# EAGLE design PCB_Tester2_V1.0 (EAGLE 8.6.3)
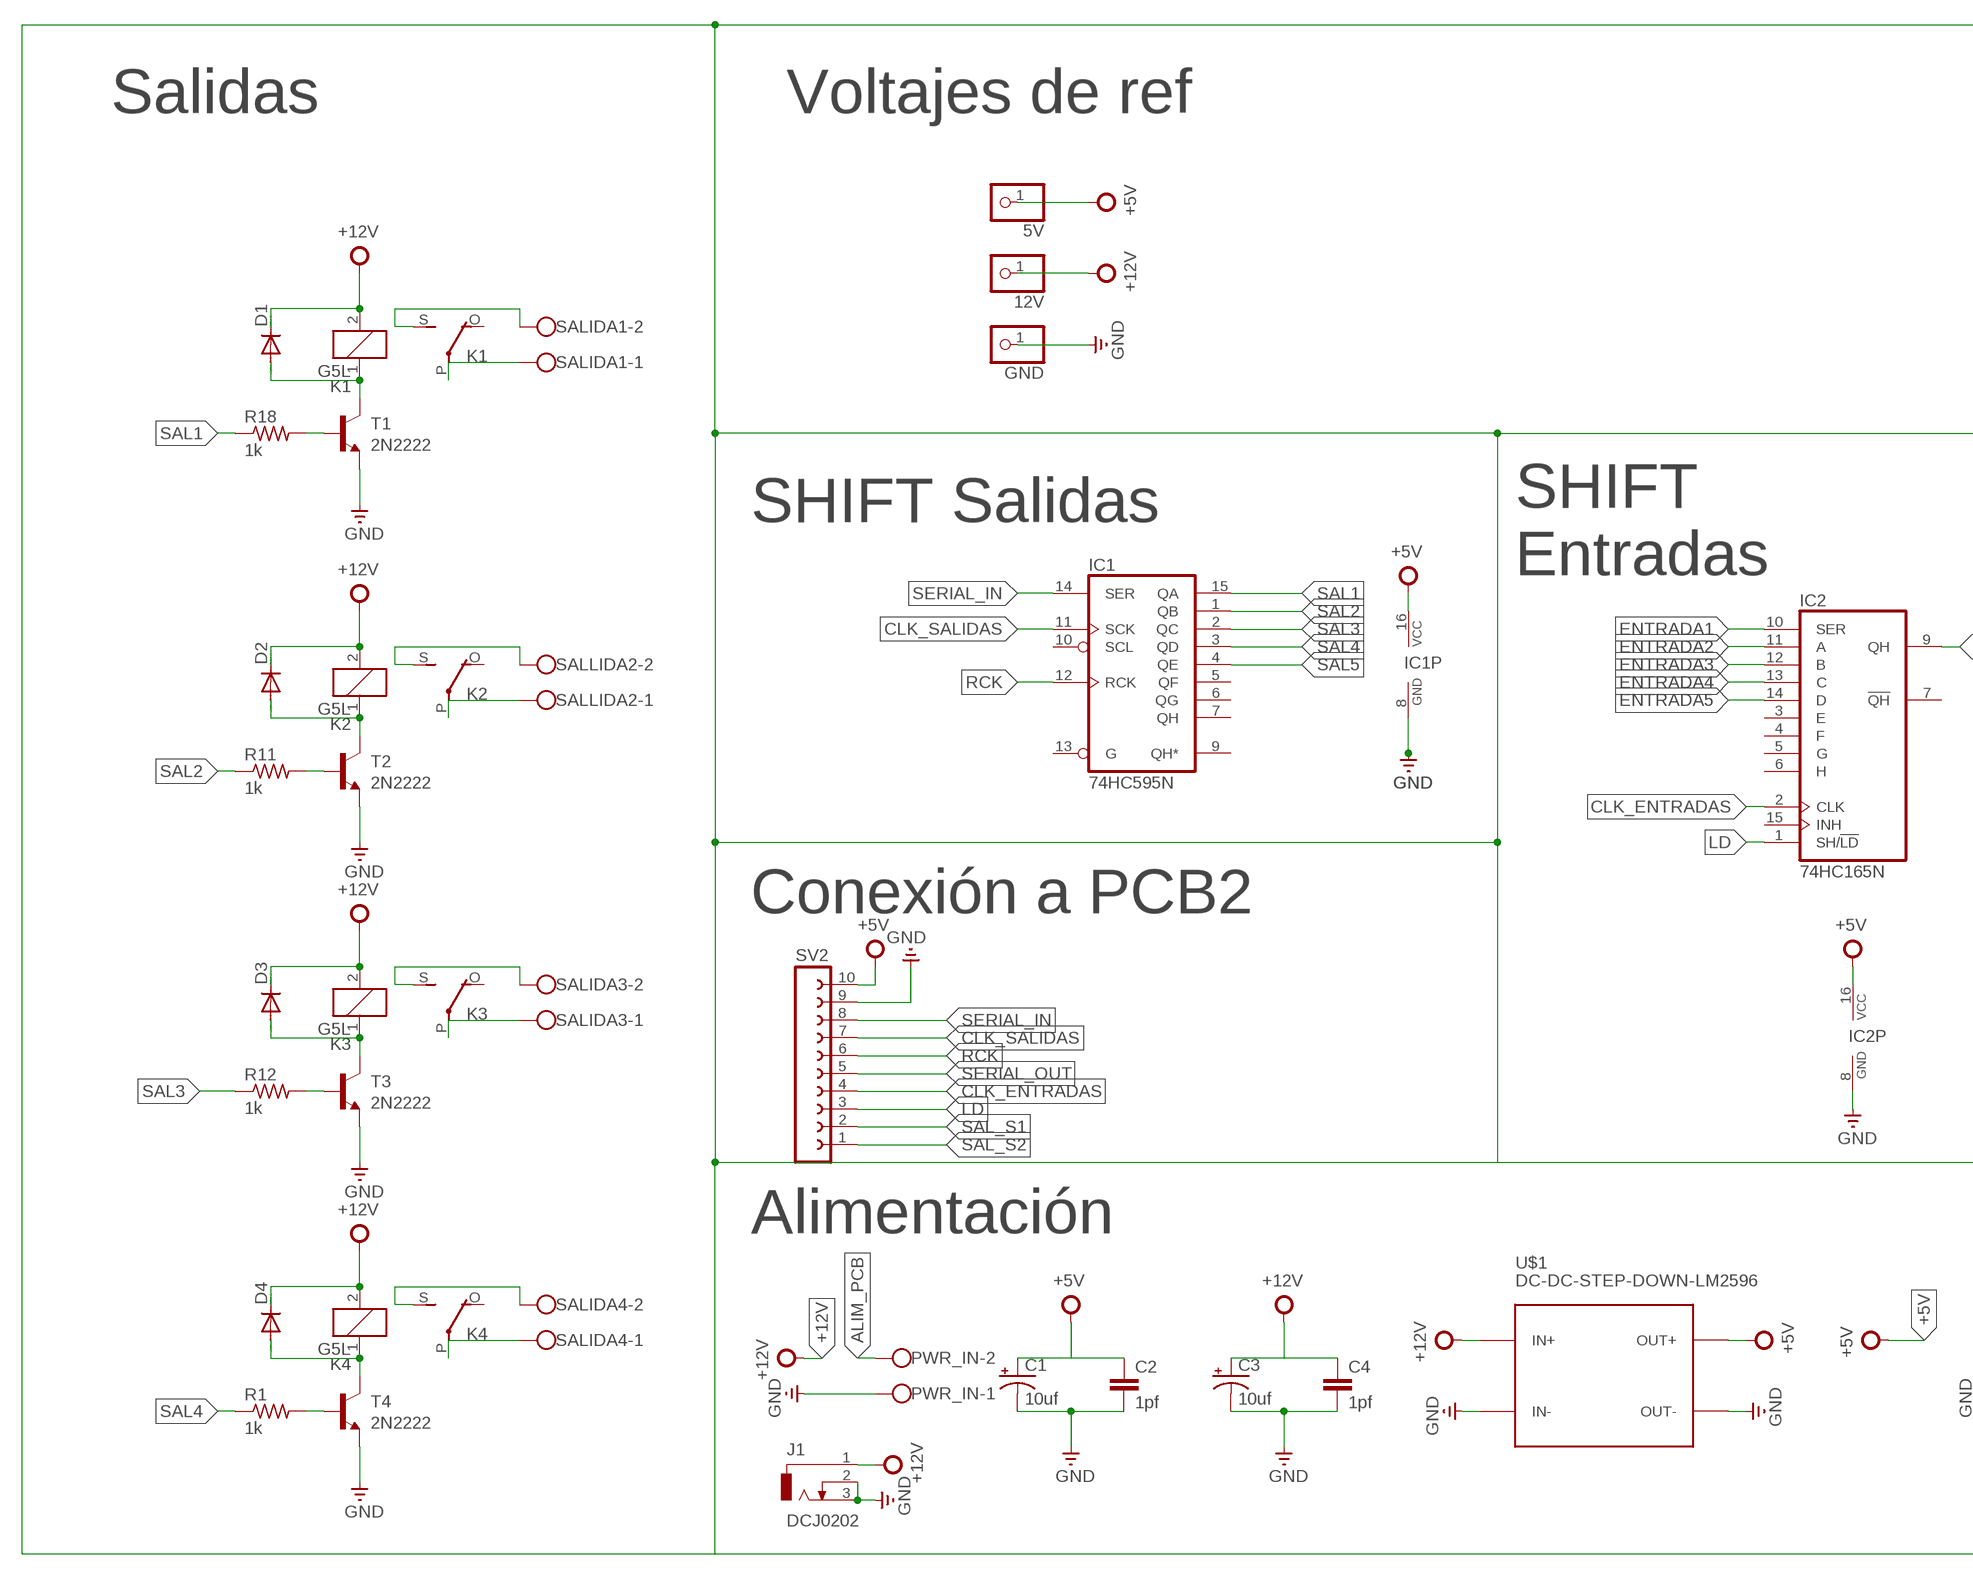
[diagram p0: schematic, sheet 1, part 1 of 2]
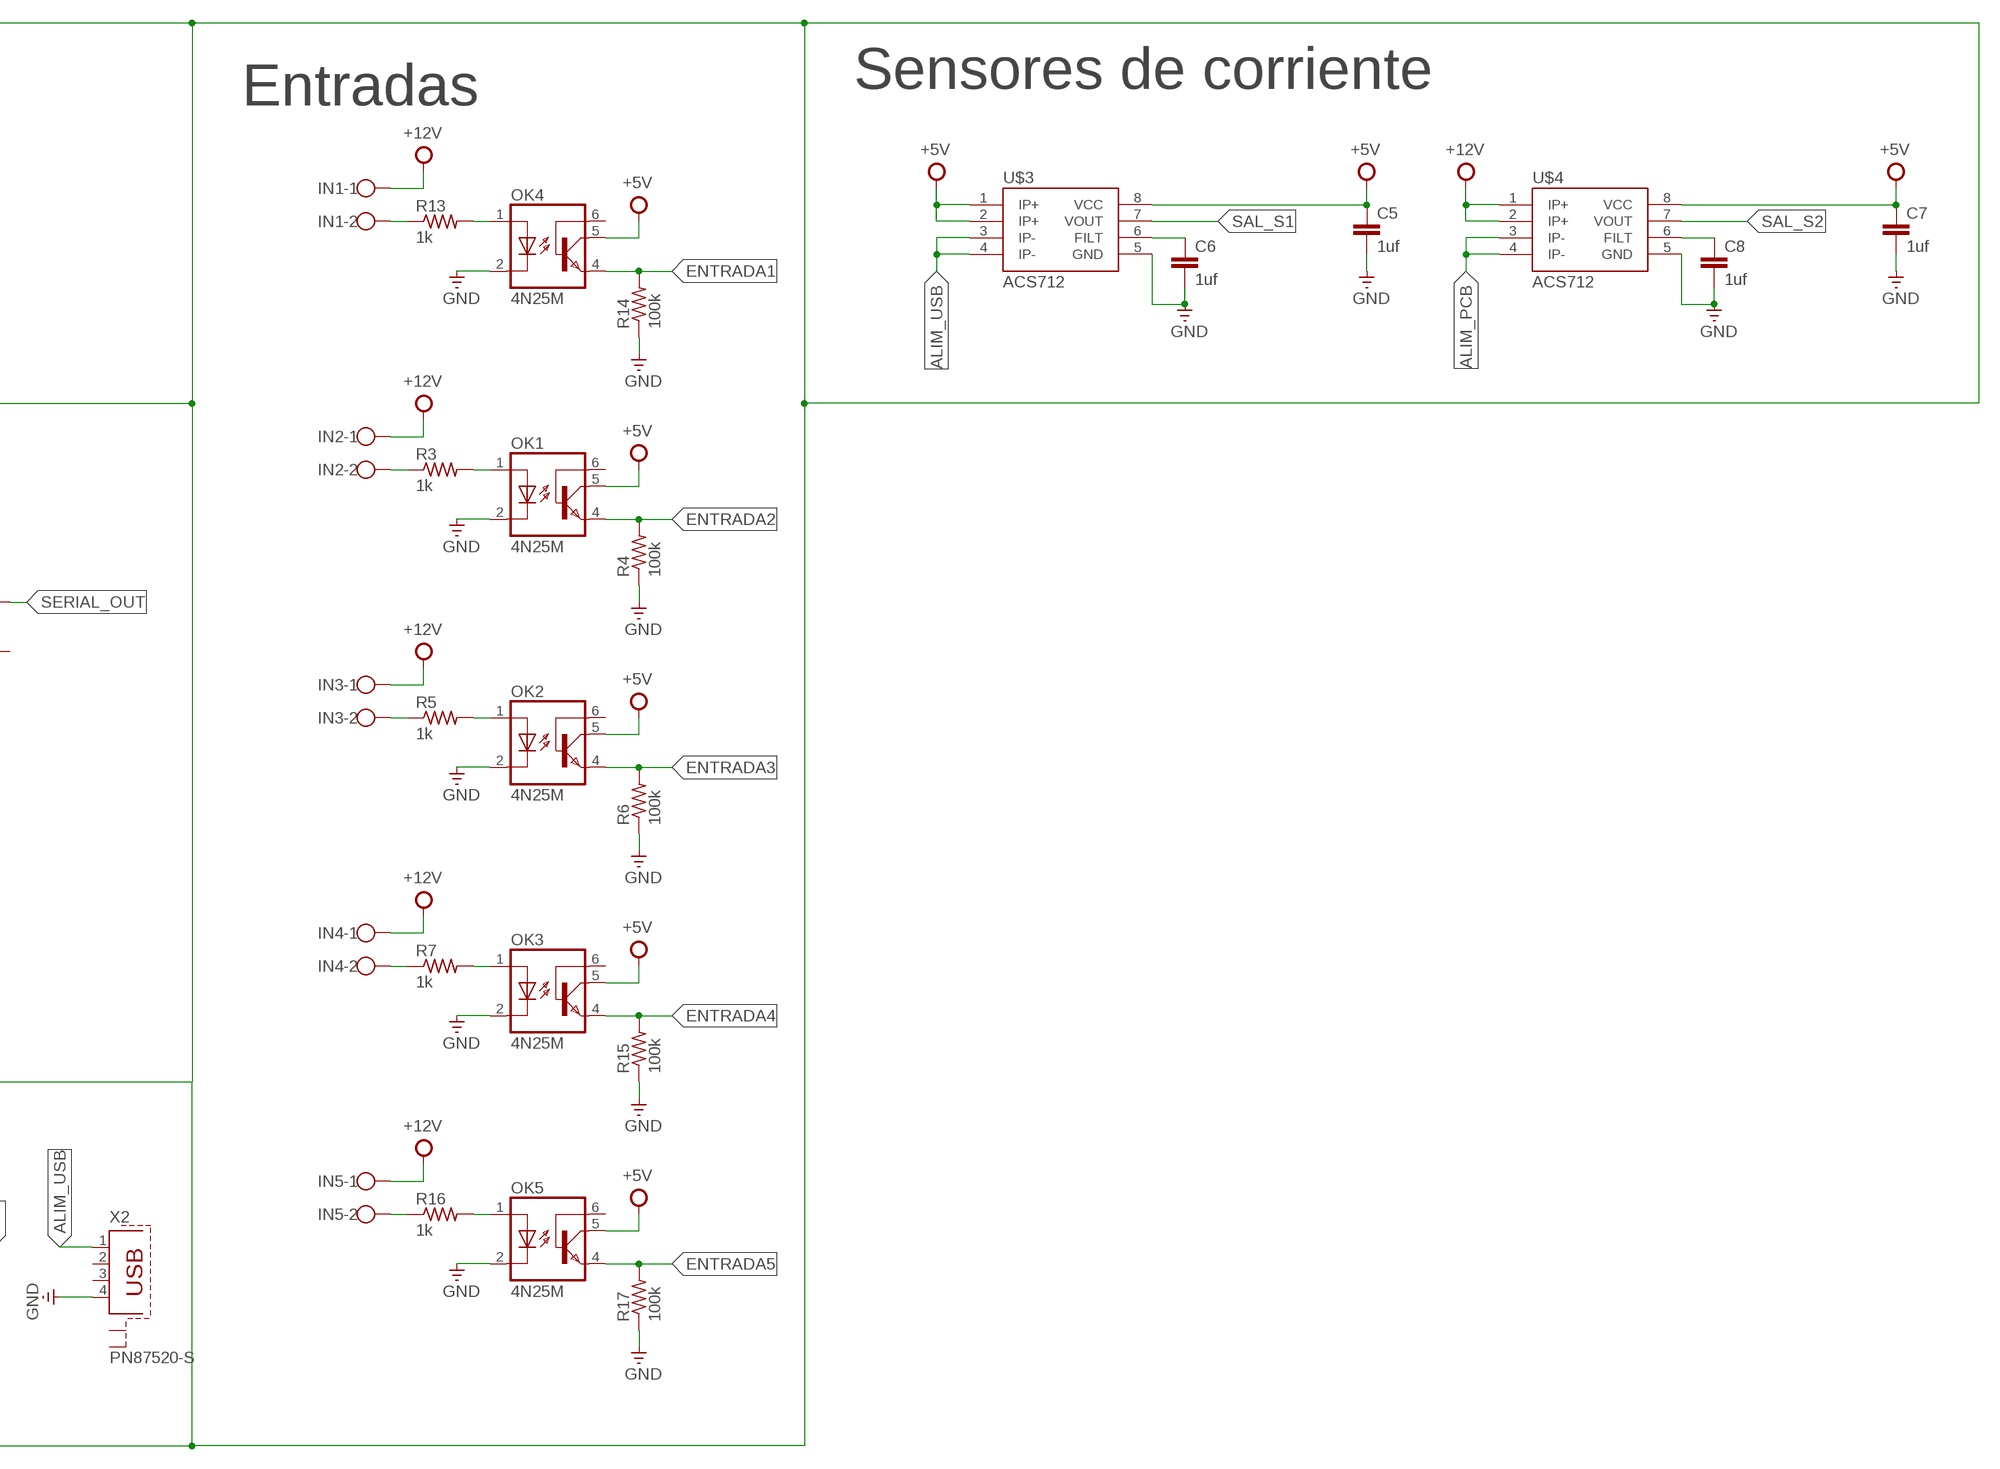
[diagram p1: schematic, sheet 1, part 2 of 2]

## Parts
5V  PINHD-1X1  [1X01]
12V  PINHD-1X1  [1X01]
C1  10uf  CPOL-USE2.5-6  [E2,5-6]
C2  1pf  C2,5-3  [C2.5-3]
C3  10uf  CPOL-USE2.5-6  [E2,5-6]
C4  1pf  C2,5-3  [C2.5-3]
C5  1uf  C2,5-3  [C2.5-3]
C6  1uf  C2,5-3  [C2.5-3]
C7  1uf  C2,5-3  [C2.5-3]
C8  1uf  C2,5-3  [C2.5-3]
D1  1N4148DO35-7  [DO35-7]
D2  1N4148DO35-7  [DO35-7]
D3  1N4148DO35-7  [DO35-7]
D4  1N4148DO35-7  [DO35-7]
GND  PINHD-1X1  [1X01]
IC1  74HC595N  [DIL16]
IC2  74HC165N  [DIL16]
IN1  W237-102  [W237-102]
IN2  W237-102  [W237-102]
IN3  W237-102  [W237-102]
IN4  W237-102  [W237-102]
IN5  W237-102  [W237-102]
J1  DCJ0202  [DCJ0202]
K1  G5L  [G5LE]
K2  G5L  [G5LE]
K3  G5L  [G5LE]
K4  G5L  [G5LE]
OK1  4N25M  [DIL06]
OK2  4N25M  [DIL06]
OK3  4N25M  [DIL06]
OK4  4N25M  [DIL06]
OK5  4N25M  [DIL06]
PWR_IN  W237-102  [W237-102]
R1  1k  R-US_0207/7  [0207/7]
R3  1k  R-US_0207/7  [0207/7]
R4  100k  R-US_0207/7  [0207/7]
R5  1k  R-US_0207/7  [0207/7]
R6  100k  R-US_0207/7  [0207/7]
R7  1k  R-US_0207/7  [0207/7]
R11  1k  R-US_0207/7  [0207/7]
R12  1k  R-US_0207/7  [0207/7]
R13  1k  R-US_0207/7  [0207/7]
R14  100k  R-US_0207/7  [0207/7]
R15  100k  R-US_0207/7  [0207/7]
R16  1k  R-US_0207/7  [0207/7]
R17  100k  R-US_0207/7  [0207/7]
R18  1k  R-US_0207/7  [0207/7]
SALIDA1  W237-102  [W237-102]
SALIDA3  W237-102  [W237-102]
SALIDA4  W237-102  [W237-102]
SALLIDA2  W237-102  [W237-102]
SV2  FE10-1  [FE10]
T1  2N2222  [TO18]
T2  2N2222  [TO18]
T3  2N2222  [TO18]
T4  2N2222  [TO18]
U$1  DC-DC-STEP-DOWN-LM2596  [DC-DC-STEP-DOWN-LM2596]
U$3  ACS712  [SO08]
U$4  ACS712  [SO08]
X2  PN87520-S  [PN87520-S]

## Nets
+5V: 5V.1 C1.+ C2.1 C5.1 C7.1 IC1.16(VCC) IC2.16(VCC) OK1.5(COL) OK2.5(COL) OK3.5(COL) OK4.5(COL) OK5.5(COL) SV2.10 U$1.OUT+ U$3.1(IP+) U$3.2(IP+) U$3.8(VCC) U$4.8(VCC)
+12V: 12V.1 C3.+ C4.1 D1.C D2.C D3.C D4.C IN1.1 IN2.1 IN3.1 IN4.1 IN5.1 J1.1 K1.2 K2.2 K3.2 K4.2 U$1.IN+ U$4.1(IP+) U$4.2(IP+)
ALIM_PCB: PWR_IN.2 U$4.3(IP-) U$4.4(IP-)
ALIM_USB: U$3.3(IP-) U$3.4(IP-) X2.1
CLK_ENTRADAS: IC2.2(CLK) SV2.4
CLK_SALIDAS: IC1.11(SCK) SV2.7
ENTRADA1: IC2.10(SER) OK4.4(EMI) R14.2
ENTRADA2: IC2.11(A) OK1.4(EMI) R4.2
ENTRADA3: IC2.12(B) OK2.4(EMI) R6.2
ENTRADA4: IC2.13(C) OK3.4(EMI) R15.2
ENTRADA5: IC2.14(D) OK5.4(EMI) R17.2
GND: C1.- C2.2 C3.- C4.2 C5.2 C6.2 C7.2 C8.2 GND.1 IC1.8(GND) IC2.8(GND) J1.2 J1.3 OK1.2(C) OK2.2(C) OK3.2(C) OK4.2(C) OK5.2(C) PWR_IN.1 R4.1 R6.1 R14.1 R15.1 R17.1 SV2.9 T1.1(E) T2.1(E) T3.1(E) T4.1(E) U$1.IN- U$1.OUT- U$3.5(GND) U$4.5(GND) X2.4
LD: IC2.1(SH/!LD) SV2.3
N$1: D4.A K4.1 T4.3(C)
N$2: R1.2 T4.2(B)
N$3: K4.S(2:S) SALIDA4.2
N$4: K4.P(2:P) SALIDA4.1
N$5: IN2.2 R3.1
N$8: OK1.1(A) R3.2
N$10: IN3.2 R5.1
N$12: OK2.1(A) R5.2
N$17: D2.A K2.1 T2.3(C)
N$18: R11.2 T2.2(B)
N$19: K2.S(2:S) SALLIDA2.2
N$20: K2.P(2:P) SALLIDA2.1
N$21: D3.A K3.1 T3.3(C)
N$22: R12.2 T3.2(B)
N$23: K3.S(2:S) SALIDA3.2
N$24: K3.P(2:P) SALIDA3.1
N$25: IN1.2 R13.1
N$26: OK4.1(A) R13.2
N$27: IN4.2 R7.1
N$28: OK3.1(A) R7.2
N$29: IN5.2 R16.1
N$30: OK5.1(A) R16.2
N$31: D1.A K1.1 T1.3(C)
N$32: R18.2 T1.2(B)
N$33: K1.S(2:S) SALIDA1.2
N$34: K1.P(2:P) SALIDA1.1
N$35: C6.1 U$3.6(FILT)
N$36: C8.1 U$4.6(FILT)
RCK: IC1.12(RCK) SV2.6
SAL1: IC1.15(QA) R18.1
SAL2: IC1.1(QB) R11.1
SAL3: IC1.2(QC) R12.1
SAL4: IC1.3(QD) R1.1
SAL5: IC1.4(QE)
SAL_S1: SV2.2 U$3.7(VOUT)
SAL_S2: SV2.1 U$4.7(VOUT)
SERIAL_IN: IC1.14(SER) SV2.8
SERIAL_OUT: IC2.9(QH) SV2.5
Unconnected: IC1.5(QF) IC1.6(QG) IC1.7(QH) IC1.9(QH*) IC1.10(SCL) IC1.13(G) IC2.3(E) IC2.4(F) IC2.5(G) IC2.6(H) IC2.7(!QH) IC2.15(INH) K1.O(2:O) K2.O(2:O) K3.O(2:O) K4.O(2:O) OK1.6(BAS) OK2.6(BAS) OK3.6(BAS) OK4.6(BAS) OK5.6(BAS) X2.2 X2.3 X2.S1 X2.S2

## Notes on the sheet
- Salidas | Voltajes de ref | Entradas | Sensores de corriente
- SHIFT Salidas
- SHIFT
  Entradas
- Conexión a PCB2
- Alimentación

## Library data of the parts
5V 12V GND = adafruit:PINHD-1X1: Pin header 1x1 for 0.1" spacing With round pins
C1 C3 = adafruit:CPOL-US: POLARIZED CAPACITOR, American symbol
C2 C4-C8 = capacitor-wima:C: CAPACITOR naming: grid - package width
D1-D4 = diode:1N4148: DIODE high speed (Philips)
IC1 = 74xx-eu:74*595: 8-bit SHIFT REGISTER, output latch
IC2 = 74xx-eu:74*165: 8-bit parallel load SHIFT REGISTER
IN1-IN5 PWR_IN SALIDA1 SALIDA3 SALIDA4 SALLIDA2 = con-wago-500:W237-102: WAGO SCREW CLAMP; MPN: 237-102; OC_FARNELL: unknown; OC_NEWARK: 70K9898
J1 = con-jack:DCJ0202: DC POWER JACK Source: DCJ0202.pdf; OC_FARNELL: unknown; OC_NEWARK: unknown
K1-K4 = relay:G5L: RELAY 1 x switch, 10 A/120 V AC, 8 A/30 V ADC, Omron; OC_FARNELL: unknown; OC_NEWARK: unknown
OK1-OK5 = optocoupler:4N*?M: General Purpose 6-Pin Phototransistor Optocouplers Source: http://www.fairchildsemi.com/ds/4N/4N35-M.pdf; MPN: 4N25-M; OC_FARNELL: 1021349; OC_NEWARK: 98K9084
R1 R3-R7 R11-R18 = rcl:R-US_: RESISTOR, American symbol; SPICEPREFIX: R
SV2 = con-lsta:FE10-1: FEMALE HEADER; OC_FARNELL: unknown; OC_NEWARK: unknown
T1-T4 = transistor:2N2222: NPN TRANSISTOR
U$1 = diy-modules:DC-DC-STEP-DOWN-LM2596: DC/DC Step-Down Regulator based on LM2596-ADJ chip LM2596 datasheet available here: http://www.ti.com/lit/ds/symlink/lm2596.pdf Click here to find device on ebay.com <http://www.ebay.com/sch/lm2596+power+regulator>
U$3 U$4 = SparkFun:ACS712
X2 = con-berg:PN87520-S; OC_FARNELL: unknown; OC_NEWARK: unknown

## Board
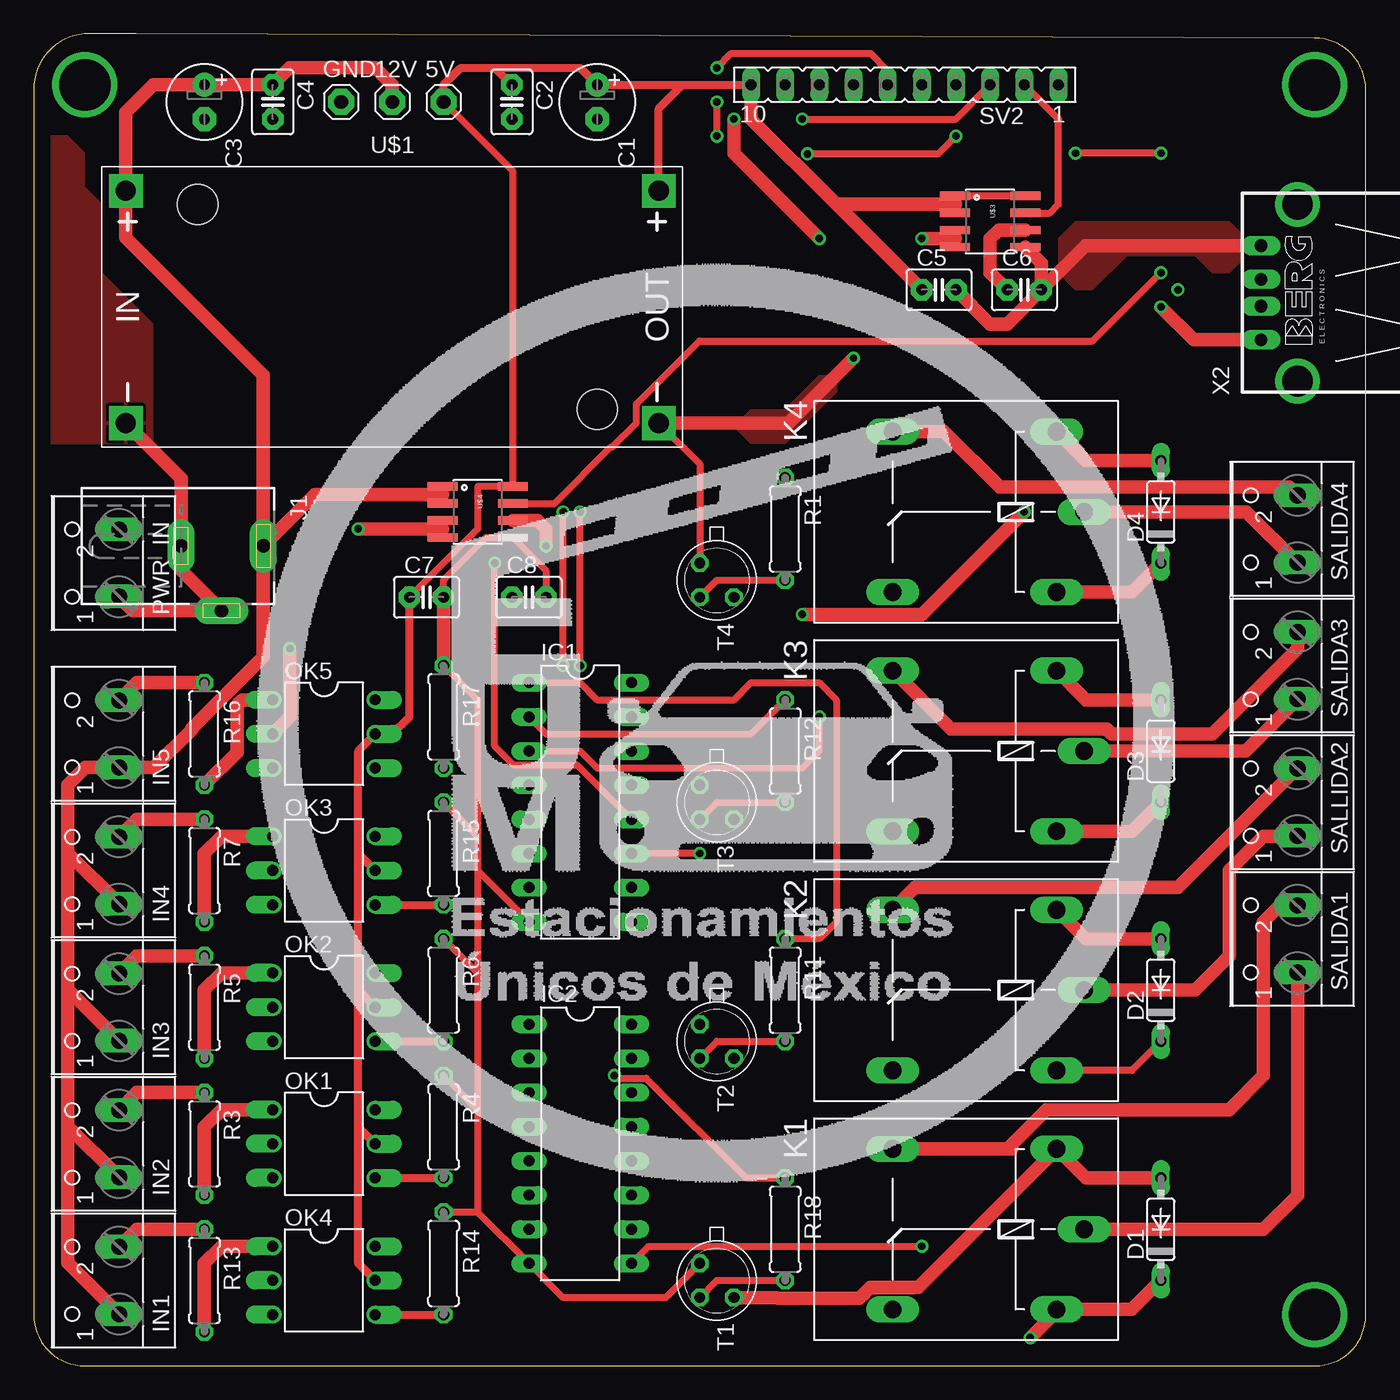
[diagram p2: board, top side]
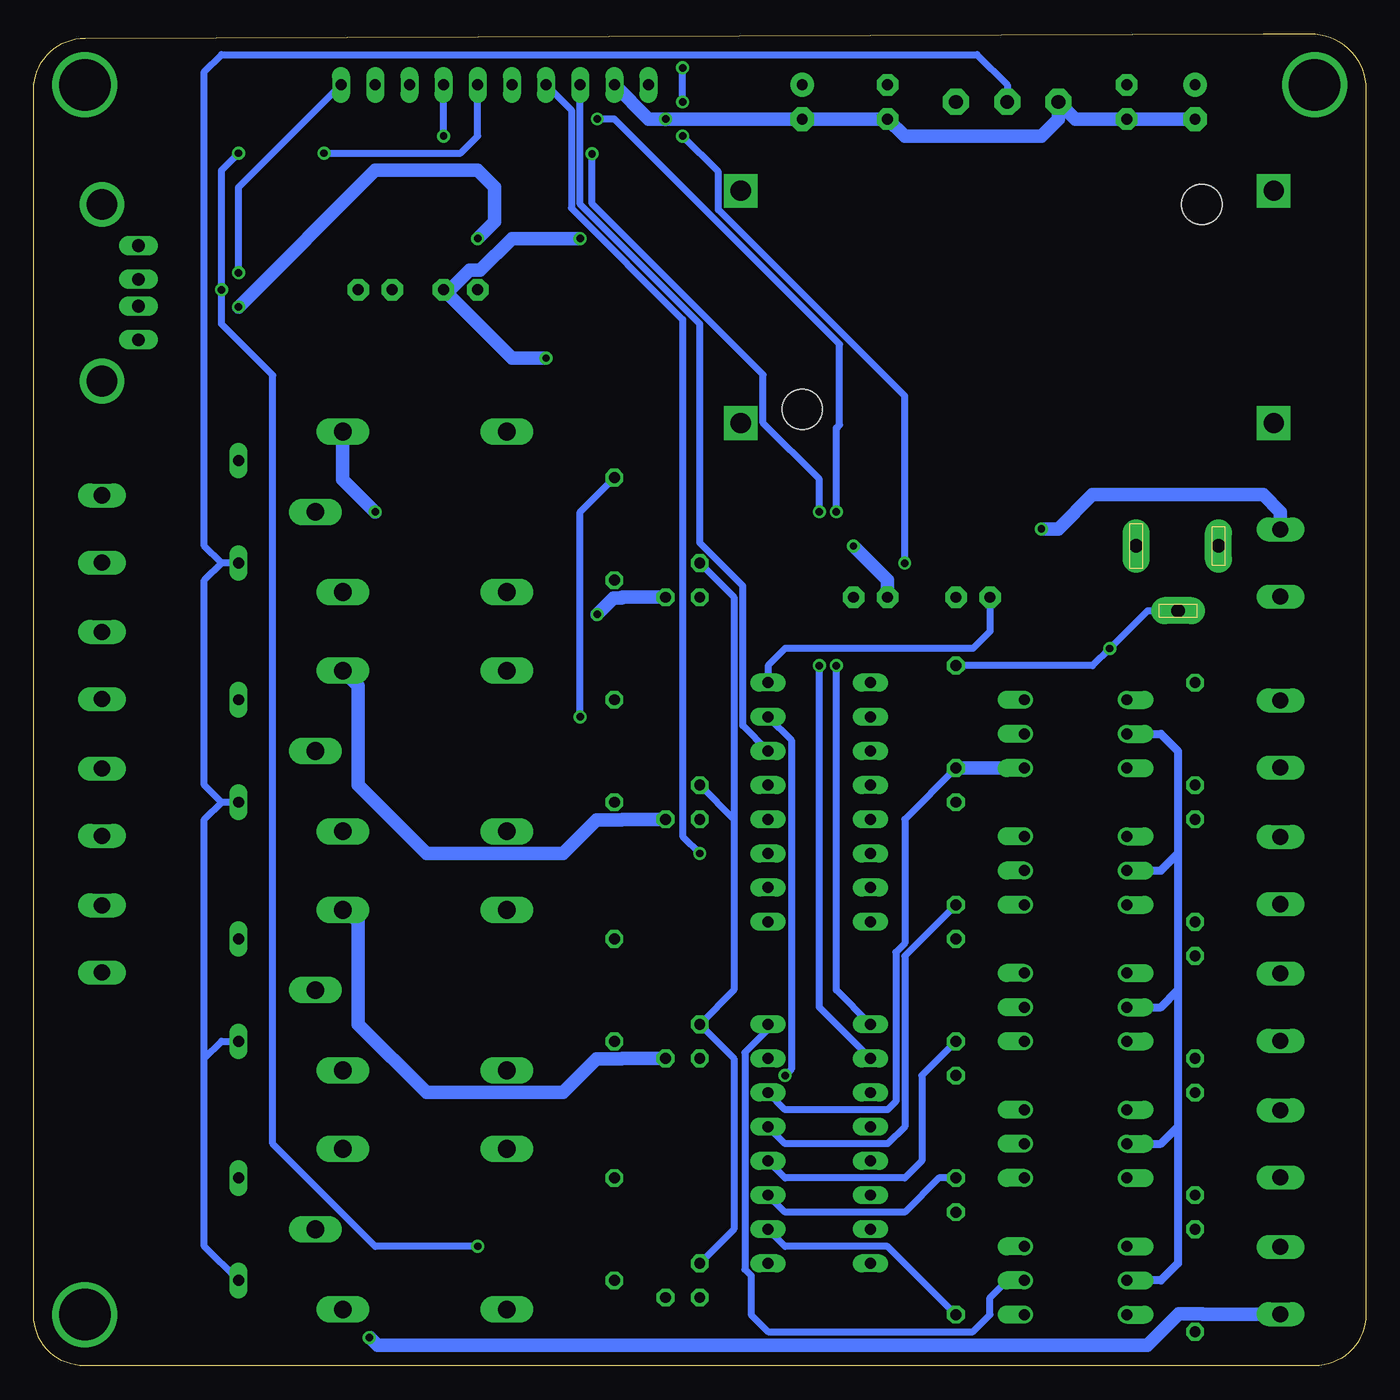
[diagram p3: board, bottom side, seen from below]

Size 99.06 x 99.06 mm. Coordinates in mm from the lower left corner, seen from the top.
Outline: 0,3.81 arc90 3.81,0 95.27,0 arc90 99.06,3.79 99.06,94.9 arc90 95.23,98.73 7.62,99.06 4.14,99.06 arc90 0,94.92 0,3.81
Copper layers (1*16): Top 0.035mm / dielectric 1.5mm / Bottom 0.035mm
Design rules "default": minimum track width 6mil, minimum drill 0.35mm, track to track 6mil, track to pad 6mil, pad to pad 6mil, via to via 6mil, smd to smd 6mil, copper to edge 40mil, drill to drill 6mil, minimum pad ring 10mil, minimum via ring 8mil, stop-mask expansion 4mil, vias tented up to drill 0mil, thermal gap 10mil

### Footprints (pad centres in the part's own frame; a part is rotated, then mirrored left to right if it is on the bottom)
1X01 = drill 1.016 pad 1.93 octagon: 1 0,0
E2,5-6 = drill 0.813 pad 1.778: + -1.27,0 | drill 0.813 pad 1.778 octagon: - 1.27,0
C2.5-3 = drill 0.813 pad 1.6 octagon: 1 -1.27,0; 2 1.27,0
DO35-7 = drill 0.813 long: A 3.81,0; C -3.81,0
DIL16 = drill 0.813 long: 1 -8.89,-3.81; 2 -6.35,-3.81; 3 -3.81,-3.81; 4 -1.27,-3.81; 5 1.27,-3.81; 6 3.81,-3.81; 7 6.35,-3.81; 8 8.89,-3.81; 9 8.89,3.81; 10 6.35,3.81; 11 3.81,3.81; 12 1.27,3.81; 13 -1.27,3.81; 14 -3.81,3.81; 15 -6.35,3.81; 16 -8.89,3.81
W237-102 = drill 1.194 long: 1 -2.5,-1.27; 2 2.5,-1.27
DCJ0202 = drill 1 pad 2 long: 1 0,3.1; 2 4.8,0; 3 0,-3
G5LE = drill 1.321 long: 1 -7.493,-5.969; 2 -7.493,5.969; O 4.699,5.969; P -9.525,0; S 4.699,-5.969
DIL06 = drill 0.813 offset: 1 -2.54,-3.81; 2 0,-3.81; 3 2.54,-3.81; 4 2.54,3.81; 5 0,3.81; 6 -2.54,3.81
0207/7 = drill 0.813 octagon: 1 -3.81,0; 2 3.81,0
FE10 = drill 0.813 long: 1 -11.43,0; 2 -8.89,0; 3 -6.35,0; 4 -3.81,0; 5 -1.27,0; 6 1.27,0; 7 3.81,0; 8 6.35,0; 9 8.89,0; 10 11.43,0
TO18 = drill 0.813 octagon: 1 -1.27,-1.27; 2 1.27,-1.27; 3 1.27,1.27
DC-DC-STEP-DOWN-LM2596 = drill 1.5 pad 2.5 square: IN+ -19.812,8.636; IN- -19.812,-8.636; OUT+ 19.812,8.636; OUT- 19.812,-8.636 | hole 3: -14.478,7.62; 15.24,-7.62
SO08 = smd 0.61 x 2.21: 1 -1.905,-2.616; 2 -0.635,-2.616; 3 0.635,-2.616; 4 1.905,-2.616; 5 1.905,2.616; 6 0.635,2.616; 7 -0.635,2.616; 8 -1.905,2.616
PN87520-S = drill 0.95 long: 1 -3.5,2.71; 2 -1,2.71; 3 1,2.71; 4 3.5,2.71 | drill 2.3 pad 2.9: S1 -6.57,0; S2 6.57,0

### Placement (x,y rotation side)
5V  30.48,93.98 0 top
12V  26.67,93.98 0 top
C1  41.91,93.98 270 top
C2  35.56,93.98 270 top
C3  12.7,93.98 270 top
C4  17.78,93.98 270 top
C5  67.31,80.01 0 top
C6  73.66,80.01 0 top
C7  29.21,57.15 0 top
C8  36.83,57.15 0 top
D1  83.82,10.16 90 top
D2  83.82,27.94 90 top
D3  83.82,45.72 90 top
D4  83.82,63.5 90 top
GND  22.86,93.98 0 top
IC1  40.64,41.91 270 top
IC2  40.64,16.51 270 top
IN1  5.08,6.35 90 top
IN2  5.08,16.51 90 top
IN3  5.08,26.67 90 top
IN4  5.08,36.83 90 top
IN5  5.08,46.99 90 top
J1  13.97,60.96 270 top
K1  68.58,10.16 180 top
K2  68.58,27.94 180 top
K3  68.58,45.72 180 top
K4  68.58,63.5 180 top
OK1  21.59,16.51 270 top
OK2  21.59,26.67 270 top
OK3  21.59,36.83 270 top
OK4  21.59,6.35 270 top
OK5  21.59,46.99 270 top
PWR_IN  5.08,59.69 90 top
R1  55.88,62.23 270 top
R3  12.7,16.51 270 top
R4  30.48,17.78 270 top
R5  12.7,26.67 270 top
R6  30.48,27.94 270 top
R7  12.7,36.83 270 top
R11  55.88,27.94 270 top
R12  55.88,45.72 270 top
R13  12.7,6.35 270 top
R14  30.48,7.62 270 top
R15  30.48,38.1 270 top
R16  12.7,46.99 270 top
R17  30.48,48.26 270 top
R18  55.88,10.16 270 top
SALIDA1  92.71,31.75 90 top
SALIDA3  92.71,52.07 90 top
SALIDA4  92.71,62.23 90 top
SALLIDA2  92.71,41.91 90 top
SV2  64.77,95.25 180 top
T1  50.8,6.35 270 top
T2  50.8,24.13 270 top
T3  50.8,41.91 270 top
T4  50.8,58.42 270 top
U$1  26.67,78.74 0 top
U$3  71.12,85.09 270 top
U$4  33.02,63.5 270 top
X2  93.98,79.79 90 top

### Tracks (layer width: path | path; a pad name or v marks a point on that pad's centre or on a via)
+5V
  Top 0.152: 68.53,86.87 U$3.1
  Top 0.508: 5V.1 35.64,88.82 U$4.8 33.02,65.41 33.02,62.23 31.68,60.88 31.67,60.88 C7.1 | U$3.2 68.53,85.75 68.53,86.36 68.53,86.87 | U$3.1 U$3.8
  Top 0.61: 5V.1 30.48,95.25 31.75,96.52 34.29,96.52 | 34.29,96.52 C2.1 | 34.29,96.52 40.64,96.52 C1.+ 48.26,95.25 | 48.26,95.25 SV2.10 | U$1.OUT+ 46.48,93.47 48.26,95.25 | OK1.5 24.13,17.78 | 24.13,17.78 24.13,27.94 | 24.13,27.94 24.13,38.1 | 24.13,38.1 24.13,45.72 OK5.5 26.67,46.99 27.94,48.26 C7.1 | OK4.5 24.13,7.62 24.13,17.78 | OK2.5 24.13,27.94 | OK3.5 24.13,38.1
  Top 1.016: SV2.10 53.34,92.71 59.69,86.36 | 59.69,86.36 C5.1 | 68.53,86.36 59.69,86.36
  Bottom 0.508: C7.1 27.94,54.61 29.21,53.34 43.18,53.34 44.45,52.07 IC1.16 | IC2.16 44.45,25.03 46.18,23.3 46.18,7.18 45.72,6.72 45.72,3.81 44.45,2.54 29.21,2.54 27.94,3.81 27.94,5.08 26.67,6.35 OK4.5
+12V  (via drill 0.55)
  Top 0.508: D2.C 81.66,21.97 K2.2 | 81.66,4.19 76.2,4.19 | 76.2,4.19 K1.2 | 76.01,4 76.2,4.19 | U$4.1 30.4,64.77 U$4.2
  Top 0.61: 2.54,7.66 2.54,17.82 | 2.54,27.94 2.54,27.98 | 2.54,27.98 2.54,38.1 | IN3.1 2.54,27.98
  Top 1.016: 2.54,27.94 2.54,7.66 IN1.1 | 2.54,27.94 2.54,38.1 | 2.54,38.1 2.54,43.18 3.85,44.49 IN5.1 8.93,44.49 11.73,47.3 11.73,47.39 17.07,52.73 J1.1 | IN4.1 2.58,38.1 2.54,38.1 | IN3.1 2.58,27.94 2.54,27.94 | IN2.1 2.54,17.82 | v74.11,2.1 76.01,4 | K1.2 81.66,4.19 D1.C | 12V.1 26.67,95.25 25.4,96.52 19.05,96.52 C4.1 C3.+ 8.89,95.25 6.86,93.22 U$1.IN+ 6.86,83.87 17.07,73.66 J1.1 | J1.1 20.88,64.77 30.4,64.77 | K3.2 81.66,39.75 D3.C | K4.2 81.66,57.53 D4.C
  Bottom 0.508: D1.C 86.36,8.89 86.36,22.86 | 86.36,22.86 85.09,24.13 D2.C | 86.36,22.86 86.36,40.64 85.09,41.91 | D3.C 85.09,41.91 | 85.09,41.91 86.36,43.18 86.36,58.42 85.09,59.69 | D4.C 85.09,59.69 | 85.09,59.69 86.36,60.96 86.36,96.23 85.09,97.5 28.92,97.5 26.67,95.25 12V.1
  Bottom 1.016: IN1.1 12.14,3.85 12.15,3.86 13.92,3.86 16.26,1.52 73.47,1.52 74.04,2.1 v74.11,2.1
ALIM_PCB  (via drill 0.55)
  Top 0.61: U$4.4 30.4,62.23 U$4.3
  Top 1.016: 30.4,62.23 v24.13,62.23
  Bottom 1.016: v24.13,62.23 22.86,62.23 20.32,64.77 7.62,64.77 6.35,63.5 PWR_IN.2
ALIM_USB  (via drill 0.55)
  Top 0.152: 68.53,84.43 U$3.3
  Top 0.508: U$3.4 68.53,83.21 68.53,83.82 68.53,84.43
  Top 1.016: 68.53,83.82 v66.04,83.82 | X2.1 86.27,76.29 v83.82,78.74
  Bottom 1.016: v66.04,83.82 64.77,85.09 64.77,87.63 66.04,88.9 73.66,88.9 v83.82,78.74
CLK_ENTRADAS  (via drill 0.55)
  Top 0.508: v40.64,52.07 v40.64,63.5 | v57.53,90.12 67.27,90.12 v68.58,91.44
  Bottom 0.508: IC2.2 40.64,26.67 v40.64,52.07 | v40.64,63.5 40.64,65.93 44.83,70.12 44.83,73.7 57.53,86.41 v57.53,90.12 | v68.58,91.44 SV2.4
CLK_SALIDAS  (via drill 0.55)
  Top 0.508: v49.53,38.1 IC1.11
  Bottom 0.508: SV2.7 59.08,93.37 59.08,86.09 50.8,77.81 50.8,39.37 v49.53,38.1
ENTRADA1
  Top 0.61: OK4.4 R14.2
  Bottom 0.508: R14.2 35.56,8.89 43.18,8.89 IC2.10
ENTRADA2
  Top 0.61: OK1.4 R4.2
  Bottom 0.508: R4.2 31.75,13.97 34.29,11.43 43.18,11.43 IC2.11
ENTRADA3
  Top 0.61: OK2.4 R6.2
  Bottom 0.508: R6.2 33.02,21.59 33.02,15.24 34.29,13.97 43.18,13.97 IC2.12
ENTRADA4
  Top 0.61: OK3.4 R15.2
  Bottom 0.508: R15.2 34.29,30.48 34.29,17.78 35.56,16.51 43.18,16.51 IC2.13
ENTRADA5
  Bottom 0.508: R17.2 34.29,40.64 34.29,31.41 34.95,30.75 34.95,19.66 35.56,19.05 43.18,19.05 IC2.14
  Bottom 1.016: OK5.4 R17.2
GND  (via drill 0.55)
  Top 0.152: 68.53,80.01 C5.2
  Top 0.508: 33.02,11.43 IC2.8 39.37,5.08 46.99,5.08 T1.1 | 33.02,11.43 R14.1 | R4.1 33.02,19.05 | 33.02,19.05 33.02,11.43 | R6.1 33.02,29.21 | 33.02,29.21 33.02,19.05 | R15.1 33.02,39.37 | 33.02,36.83 33.02,29.21 | R17.1 33.02,49.53 33.02,39.37 | IC1.8 33.02,36.83 | C8.2 38.1,59.13 U$4.5 33.66,61.59 30.48,58.42 C7.2 | U$1.OUT- 49.53,67.06 T4.1 | 33.02,39.37 33.02,36.83
  Top 0.61: 10.97,59.69 J1.3
  Top 1.016: C5.2 71.12,77.47 72.39,77.47 C6.2 | C6.2 74.93,81.99 U$3.5 | PWR_IN.1 7.38,56.16 J1.2 10.97,59.16 10.97,59.69 | J1.3 10.97,65.99 U$1.IN- | U$1.OUT- 56.13,70.1 v60.96,74.93 | v58.42,83.82 52.07,90.17 v52.07,92.71 | C7.2 R17.1 | v19.05,53.34 19.05,50.13 19.1,50.08 19.1,48.31 OK5.2 | C6.2 78.21,83.29 X2.4
  Bottom 0.508: J1.2 16.23,56.16 v19.05,53.34 20.32,52.07 R17.1 | T3.1 46.99,40.64 | 46.99,40.64 46.99,27.94 T2.1 46.99,22.86 46.99,10.16 T1.1 | T4.1 46.99,57.15 46.99,40.64
  Bottom 0.61: OK5.2 15.24,46.99 13.97,45.72 13.97,38.1 | 13.97,38.1 13.97,27.94 | 13.97,27.94 13.97,17.78 | 13.97,17.78 13.97,7.62 15.24,6.35 OK4.2 | OK1.2 15.24,16.51 13.97,17.78 | OK2.2 15.24,26.67 13.97,27.94 | OK3.2 15.24,36.83 13.97,38.1
  Bottom 1.016: SV2.9 53.34,92.71 v52.07,92.71 C1.- C2.2 34.29,91.44 24.13,91.44 22.86,92.71 GND.1 21.59,92.71 C4.2 C3.- | v60.96,74.93 63.5,74.93 C5.2 68.11,80.01 66.64,81.47 65.85,81.47 63.5,83.82 v58.42,83.82
  pour Top: 8.89,68.58 8.89,77.47 5.08,81.28 5.08,86.36 3.81,87.63 3.81,90.17 2.54,91.44 1.27,91.44 1.27,68.58
  pour Top: 52.07,69.85 53.34,71.12 55.88,71.12 58.42,73.66 59.69,73.66 59.69,72.39 55.88,68.58 53.34,68.58
  pour Top: 90.17,83.82 88.9,85.09 77.47,85.09 76.2,83.82 76.2,81.28 77.47,80.01 78.74,80.01 81.28,82.55 86.36,82.55 87.63,81.28 88.9,81.28 90.17,82.55
LD  (via drill 0.55)
  Top 0.508: v39.37,52.07 v39.37,63.5 | v57.15,92.71 68.58,92.71 SV2.3
  Bottom 0.508: IC2.1 39.37,27.94 v39.37,52.07 | v39.37,63.5 39.37,69.74 39.14,69.97 39.14,75.97 55.88,92.71 v57.15,92.71
N$1  (via drill 0.55)
  Top 1.016: v57.15,55.88 66.04,55.88 v73.66,63.5 | K4.1 78.23,67.31 D4.A
  Bottom 1.016: T4.3 55.28,57.15 55.33,57.1 55.93,57.1 v57.15,55.88 | v73.66,63.5 76.07,65.91 K4.1
N$2
  Top 0.508: T4.2 50.8,58.42 R1.2
N$3
  Top 1.016: SALIDA4.2 93.38,65.33 71.83,65.33 67.69,69.47 K4.S
N$4
  Top 0.508: 93.98,59.69 SALIDA4.1
  Top 1.016: K4.P 90.17,63.5 93.98,59.69
N$5
  Top 1.016: IN2.2 7.66,20.32 R3.1
N$6  (via drill 3.81)
  other vias: 95.25,95.25
N$7  (via drill 3.81)
  other vias: 95.25,3.81
N$8
  Top 1.016: R3.2 12.7,17.78 13.97,19.05 OK1.1
N$9  (via drill 3.81)
  other vias: 3.81,95.25
N$10
  Top 1.016: IN3.2 7.66,30.48 R5.1
N$12
  Top 1.016: R5.2 12.7,27.94 13.97,29.21 OK2.1
N$17
  Top 1.016: K2.1 78.23,31.75 D2.A
  Bottom 1.016: T2.3 55.28,22.86 55.33,22.81 57.2,22.81 59.69,20.32 69.85,20.32 74.93,25.4 74.93,33.02 75.82,33.91 K2.1
N$18
  Top 0.508: T2.2 50.8,24.13 R11.2
N$19
  Top 0.508: 93.94,44.41 SALLIDA2.2
  Top 1.016: K2.S 65.53,35.56 85.09,35.56 93.94,44.41
N$20
  Top 1.016: SALLIDA2.1 93.94,39.37 91.44,39.37 88.9,36.83 88.9,30.48 86.36,27.94 K2.P
N$21
  Top 1.016: K3.1 78.23,49.53 D3.A
  Bottom 1.016: T3.3 55.28,40.64 55.33,40.59 57.2,40.59 59.69,38.1 69.85,38.1 74.93,43.18 74.93,50.55 K3.1
N$22
  Top 0.508: T3.2 50.8,41.91 R12.2
N$23
  Top 0.508: SALIDA3.2 93.98,54.61
  Top 1.016: K3.S 68.2,47.37 79.78,47.37 80.16,46.99 87.63,46.99 93.98,53.34 SALIDA3.2
N$24
  Top 0.508: 93.96,49.55 SALIDA3.1
  Top 1.016: K3.P 90.13,45.72 93.96,49.55
N$25
  Top 1.016: IN1.2 7.66,10.16 R13.1
N$26
  Top 1.016: R13.2 12.7,7.62 13.97,8.89 OK4.1
N$27
  Top 1.016: IN4.2 7.66,40.64 R7.1
N$28
  Top 1.016: R7.2 12.7,38.1 13.97,39.37 OK3.1
N$29
  Top 1.016: IN5.2 7.66,50.8 R16.1
N$30
  Top 0.61: 15.24,49.53 OK5.1
  Top 1.016: R16.2 15.14,45.62 15.14,49.14 15.53,49.53 OK5.1
N$31
  Top 0.508: 61.8,5.08 62.31,5.59 65.53,5.59 K1.1
  Top 1.016: D1.A 78.23,13.97 K1.1 65.79,5.84 62.21,5.84 61.39,5.03 55.33,5.03 55.28,5.08 T1.3
N$32
  Top 0.508: T1.2 50.8,6.35 R18.2
N$33
  Top 1.016: K1.S 72.39,16.13 | 72.39,16.13 72.75,16.13 | 72.39,16.13 75.31,19.05 88.9,19.05 91.44,21.59 91.44,33.02 92.71,34.29 93.98,34.29 SALIDA1.2
N$34
  Top 0.508: 93.98,29.21 SALIDA1.1
  Top 1.016: K1.P 91.44,10.16 93.98,12.7 93.98,29.21
N$35
  Top 1.016: C6.1 71.12,81.28 71.12,83.82 71.75,84.45 U$3.6
N$36  (via drill 0.55)
  Top 1.016: U$4.6 37.46,62.87 38.1,62.23 v38.1,60.96
  Bottom 1.016: C8.1 35.56,58.42 v38.1,60.96
RCK  (via drill 0.55)
  Top 0.508: IC1.12 40.44,44.65 35.73,44.65 34.29,46.09 v34.29,59.69 | v50.8,91.44 v50.8,93.98 | v50.8,96.52 51.86,97.58 62.23,97.58 63.5,96.31 SV2.6
  Bottom 0.508: v50.8,91.44 48.14,88.78 48.14,85.96 34.29,72.11 v34.29,59.69 | v50.8,93.98 v50.8,96.52
SAL1  (via drill 0.55)
  Top 0.508: v43.18,21.59 43.38,21.39 45.55,21.39 52.97,13.97 R18.1
  Bottom 0.508: IC1.15 42.72,46.53 42.72,22.05 v43.18,21.59
SAL2
  Top 0.508: IC1.1 40.64,50.8 41.91,49.53 52.07,49.53 53.34,50.8 58.42,50.8 59.69,49.53 59.69,33.02 58.42,31.75 R11.1
SAL3
  Top 0.508: IC1.2 38.1,46.99 53.34,46.99 R12.1
SAL4  (via drill 0.55)
  Top 0.508: IC1.3 40.64,45.72 41.91,44.45 57.15,44.45 58.42,45.72 v58.42,48.26
  Bottom 0.508: v58.42,48.26 58.42,63.5 R1.1
SAL_S1
  Top 0.508: U$3.7 75.56,85.72 76.2,86.36 76.2,92.71 SV2.2
SAL_S2  (via drill 0.55)
  Top 0.508: U$4.7 38.73,64.14 42.95,68.35 43.06,68.35 44.83,70.12 44.83,71.52 49.5,76.2 78.74,76.2 v83.82,81.28
  Bottom 0.508: v83.82,81.28 83.82,87.63 SV2.1
SERIAL_IN
  Bottom 0.508: IC1.14 46.33,47.6 46.33,58 49.53,61.2 49.53,77.47 58.42,86.36 SV2.8
SERIAL_OUT  (via drill 0.55)
  Top 0.508: IC2.9 45.72,8.89 v66.04,8.89 | v83.82,90.17 v77.47,90.17
  Bottom 0.508: v66.04,8.89 73.66,8.89 81.28,16.51 81.28,73.66 85.09,77.47 v85.09,80.01 85.09,88.9 v83.82,90.17 | SV2.5 66.04,91.44 67.31,90.17 v77.47,90.17